# EAGLE schematic v1.0 (EAGLE 9.1.2)
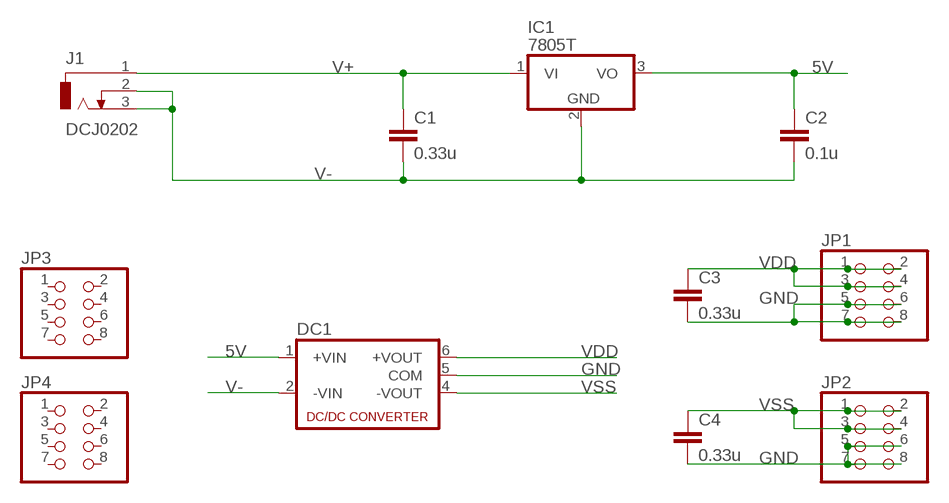
[diagram p0: schematic, sheet 1]

## Parts
C1  0.33u  C-EU050-045X075  [C050-045X075]
C2  0.1u  C-EU050-045X075  [C050-045X075]
C3  0.33u  C-EU050-045X075  [C050-045X075]
C4  0.33u  C-EU050-045X075  [C050-045X075]
DC1  NMA  [NMA]
IC1  7805T  [TO220H]
J1  DCJ0202  [DCJ0202]
JP1  PINHD-2X4  [2X04]
JP2  PINHD-2X4  [2X04]
JP3  PINHD-2X4  [2X04]
JP4  PINHD-2X4  [2X04]

## Nets
5V: C2.1 DC1.1(+VIN) IC1.3(VO)
GND: C3.2 C4.2 DC1.5(COM) JP1.5 JP1.6 JP1.7 JP1.8 JP2.5 JP2.6 JP2.7 JP2.8
V+: C1.1 IC1.1(VI) J1.1
V-: C1.2 C2.2 DC1.2(-VIN) IC1.2(GND) J1.2 J1.3
VDD: C3.1 DC1.6(+VOUT) JP1.1 JP1.2 JP1.3 JP1.4
VSS: C4.1 DC1.4(-VOUT) JP2.1 JP2.2 JP2.3 JP2.4
Unconnected: JP3.1 JP3.2 JP3.3 JP3.4 JP3.5 JP3.6 JP3.7 JP3.8 JP4.1 JP4.2 JP4.3 JP4.4 JP4.5 JP4.6 JP4.7 JP4.8

## Library data of the parts
C1-C4 = rcl:C-EU: CAPACITOR, European symbol; SPICEPREFIX: C
DC1 = dc-dc-converter:NMA: DC-DC CONVERTER; MF: C & D TECHNOLOGIES, INC; MPN: NMA0515SC; OC_FARNELL: 1021434; OC_NEWARK: 61K3064
IC1 = linear:78*: Positive VOLTAGE REGULATOR Source: http://cache.national.com/ds/LM/LM78L05.pdf http://www.fairchildsemi.com/ds/LM/LM7805.pdf
J1 = con-jack:DCJ0202: DC POWER JACK Source: DCJ0202.pdf; OC_FARNELL: unknown; OC_NEWARK: unknown
JP1-JP4 = pinhead:PINHD-2X4: PIN HEADER